# Altium schematic sheet CPLD.SchDoc: =Project
size 420 x 297 mm; Author: G.Kasprowicz; CompanyName: WUT ISE; DrawnBy: G.Kasprowicz; Organization: WUT ISE; Address1: PW ISE; Address2: Nowowiejska 15/19 00-665 Warsaw; Address3: gkasprow@gmail.com; SheetNumber: 2; SheetTotal: 9; ModifiedBy: -; CheckedDate: -; Title2: CPLD; DivGrp: WUT ISE; Designer: G.Kasprowicz; SPICEModelCacheRYPVXPCY: <root> / <DocumentId>RYPVXPCY</DocumentId> / </root>; ModifiedDate: -; ProjectName: Sensor Box
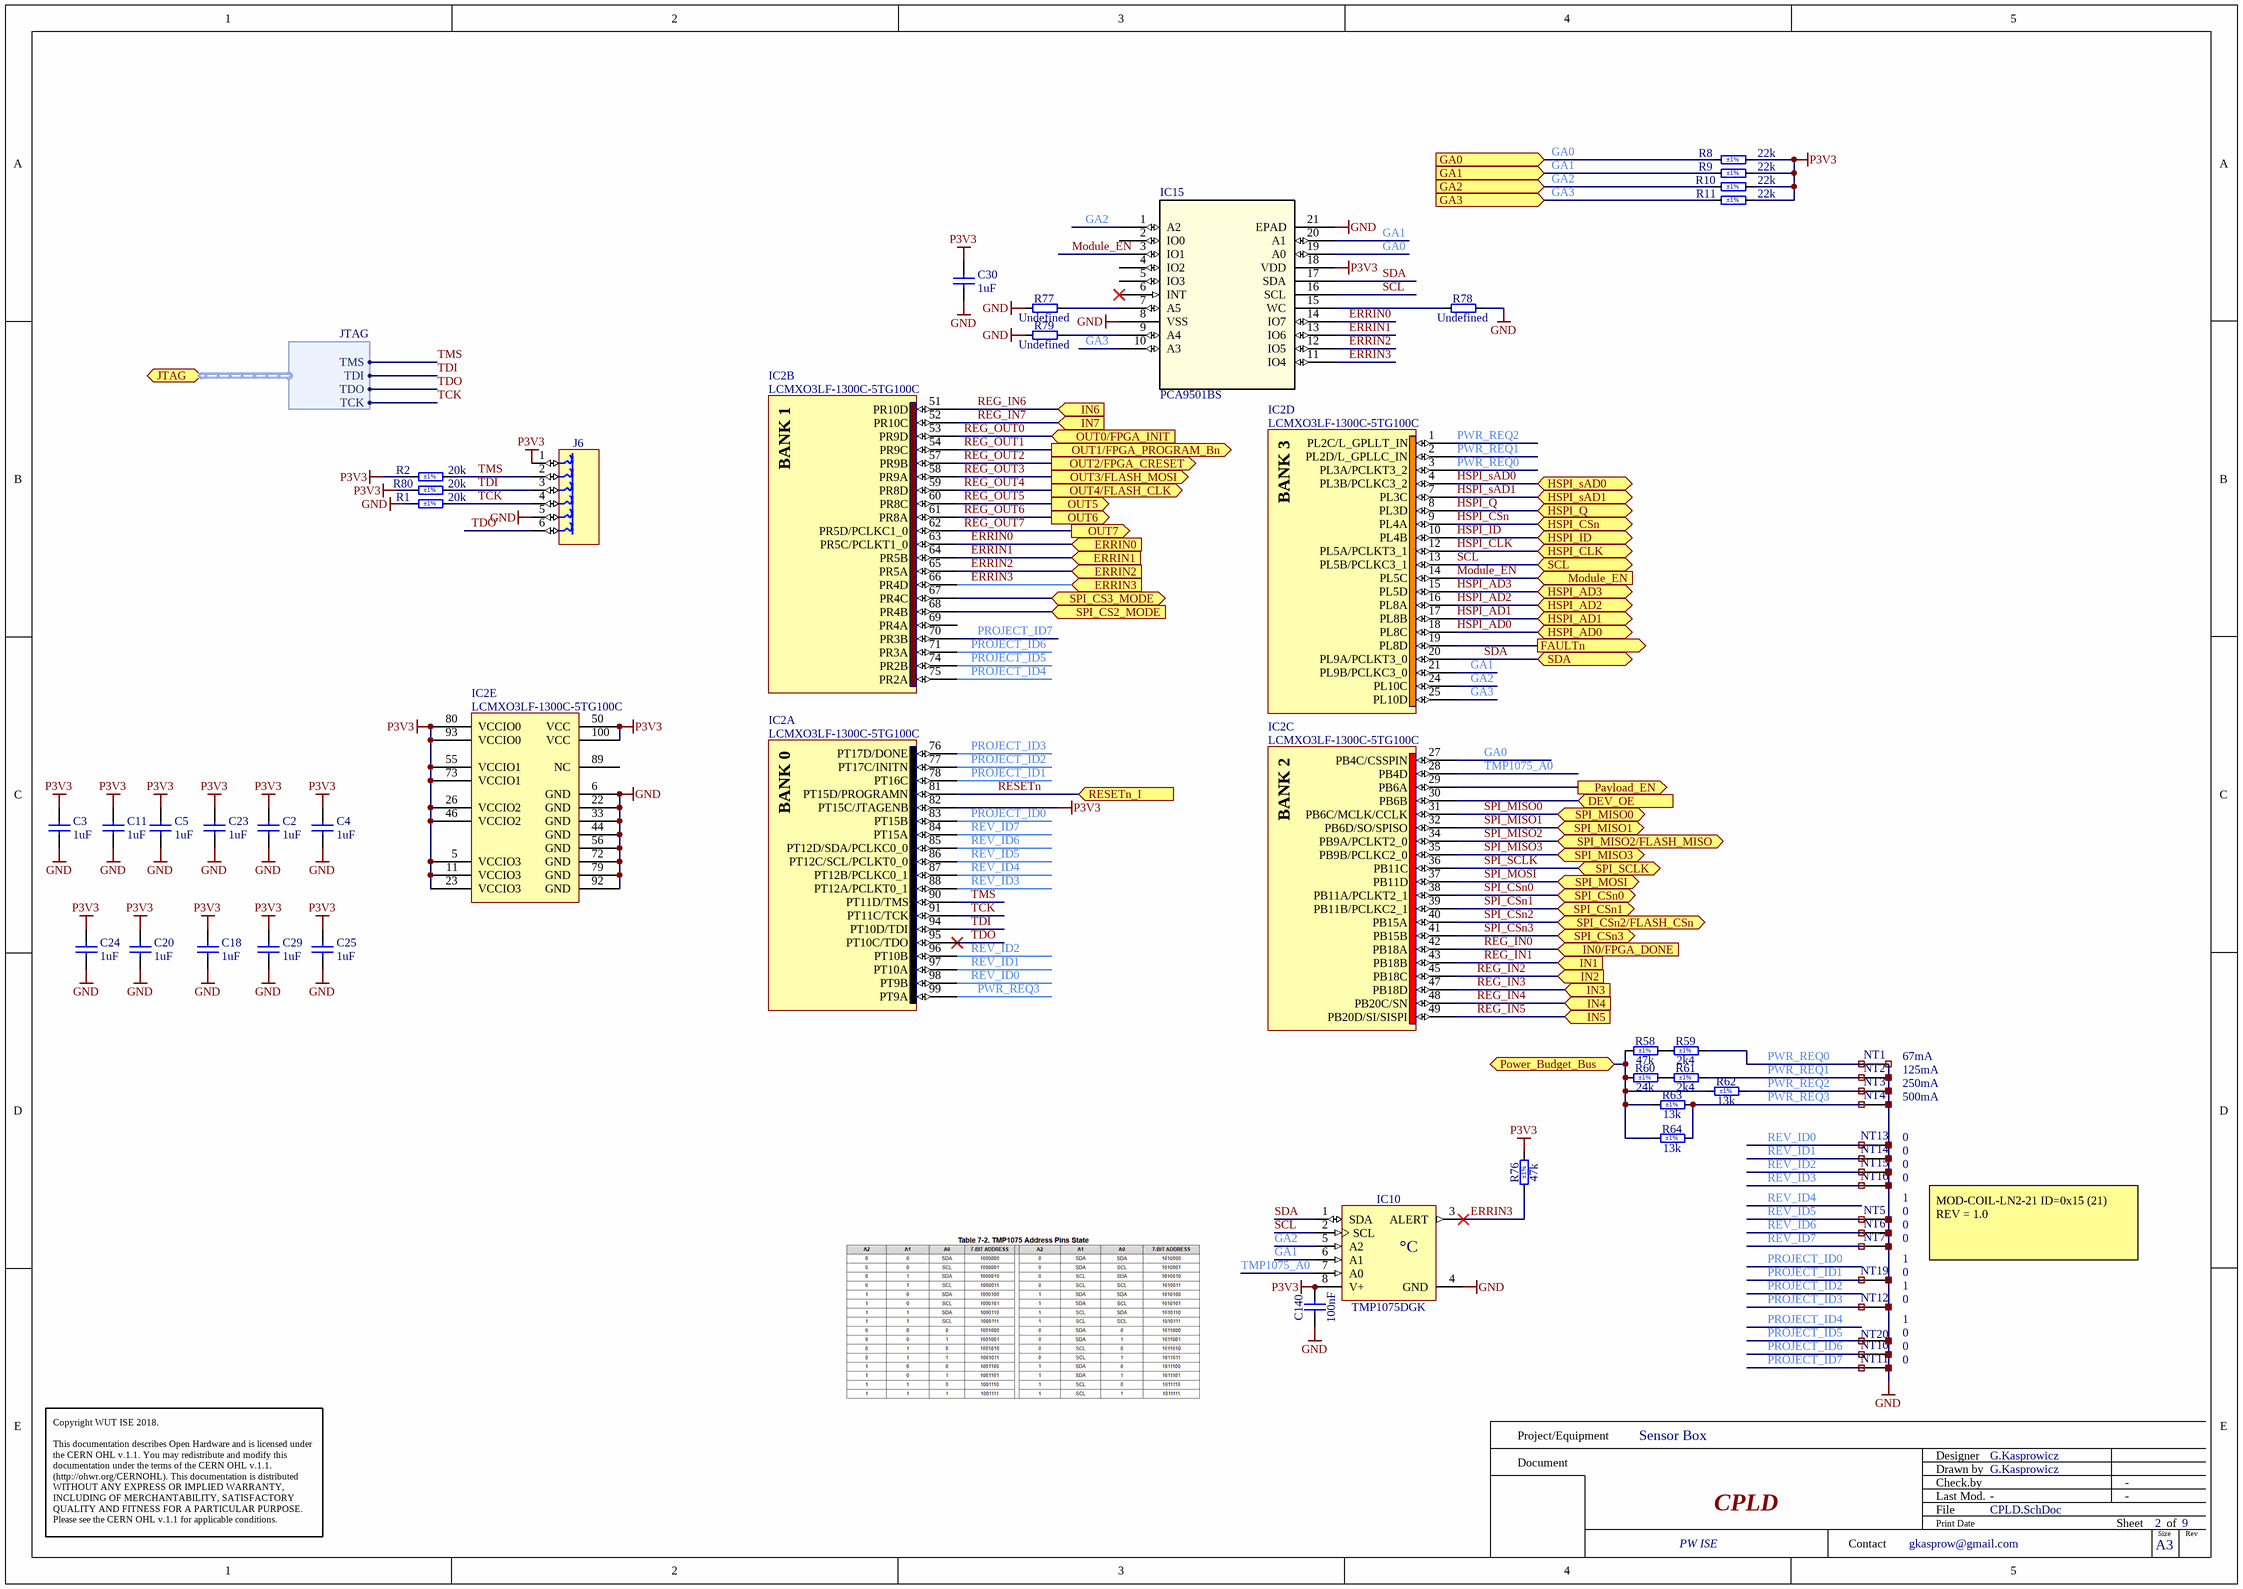
[diagram p0: CPLD.SchDoc]

## Parts
C2  1uF  [CAPC1005X55N]
C3  1uF  [CAPC1005X55N]
C4  1uF  [CAPC1005X55N]
C5  1uF  [CAPC1005X55N]
C11  1uF  [CAPC1005X55N]
C18  1uF  [CAPC1005X55N]
C20  1uF  [CAPC1005X55N]
C23  1uF  [CAPC1005X55N]
C24  1uF  [CAPC1005X55N]
C25  1uF  [CAPC1005X55N]
C29  1uF  [CAPC1005X55N]
C30  1uF  [CAPC1005X55N]
C140  100nF  [CAPC1005X55N]
IC2  LCMXO3LF-1300C-5TG100C  [QFP50P1600X1600X160-100N]  (parts A,B,C,D,E of 5)
IC10  TMP1075DGK  [SOP65P490X110-8N]
IC15  PCA9501BS  [HVQFN20_SOT662-1_5X5_NXP]
J6  TC2030-MCP  [TC2030-MCP]  (value not drawn)  (no BOM)
NT1  Net Tie  [Net Tie 3]  (value not drawn)  (net tie, no BOM)
NT2  Net Tie  [Net Tie 3]  (value not drawn)  (net tie, no BOM)
NT3  Net Tie  [Net Tie 3]  (value not drawn)  (net tie, no BOM)
NT4  Net Tie  [Net Tie 3]  (value not drawn)  (net tie, no BOM)
NT5  Net Tie  [Net Tie 3]  (value not drawn)  (net tie, no BOM)
NT6  Net Tie  [Net Tie 3]  (value not drawn)  (net tie, no BOM)
NT7  Net Tie  [Net Tie 3]  (value not drawn)  (net tie, no BOM)
NT10  Net Tie  [Net Tie 3]  (value not drawn)  (net tie, no BOM)
NT11  Net Tie  [Net Tie 3]  (value not drawn)  (net tie, no BOM)
NT12  Net Tie  [Net Tie 3]  (value not drawn)  (net tie, no BOM)
NT13  Net Tie  [Net Tie 3]  (value not drawn)  (net tie, no BOM)
NT14  Net Tie  [Net Tie 3]  (value not drawn)  (net tie, no BOM)
NT15  Net Tie  [Net Tie 3]  (value not drawn)  (net tie, no BOM)
NT16  Net Tie  [Net Tie 3]  (value not drawn)  (net tie, no BOM)
NT19  Net Tie  [Net Tie 3]  (value not drawn)  (net tie, no BOM)
NT20  Net Tie  [Net Tie 3]  (value not drawn)  (net tie, no BOM)
R1  20k  Tolerance: ±1%  [RESC1005X40N]
R2  20k  Tolerance: ±1%  [RESC1005X40N]
R8  22k  Tolerance: ±1%  [RESC1005X40N]
R9  22k  Tolerance: ±1%  [RESC1005X40N]
R10  22k  Tolerance: ±1%  [RESC1005X40N]
R11  22k  Tolerance: ±1%  [RESC1005X40N]
R58  47k  Tolerance: ±1%  [RESC1005X40N]
R59  2k4  Tolerance: ±1%  [RESC1005X40N]
R60  24k  Tolerance: ±1%  [RESC1005X40N]
R61  2k4  Tolerance: ±1%  [RESC1005X40N]
R62  13k  Tolerance: ±1%  [RESC1005X40N]
R63  13k  Tolerance: ±1%  [RESC1005X40N]
R64  13k  Tolerance: ±1%  [RESC1005X40N]
R76  47k  Tolerance: ±1%  [RESC1005X40N]
R77  Undefined  [RESC1005X40N]
R78  Undefined  [RESC1005X40N]
R79  Undefined  [RESC1005X40N]
R80  20k  Tolerance: ±1%  [RESC1005X40N]

## Ports
DEV_OE (in), ERRIN0 (in), ERRIN1 (in), ERRIN2 (in), ERRIN3 (in), FAULTn (out), GA0 (in), GA1 (in), GA2 (in), GA3 (in), HSPI_AD0 (bidir), HSPI_AD1 (bidir), HSPI_AD2 (bidir), HSPI_AD3 (bidir), HSPI_CLK (bidir), HSPI_CSn (bidir), HSPI_ID (bidir), HSPI_Q (bidir), HSPI_sAD0 (bidir), HSPI_sAD1 (bidir), IN0/FPGA_DONE (in), IN1 (in), IN2 (in), IN3 (in), IN4 (in), IN5 (in), IN6 (in), IN7 (in), JTAG (bidir, harness JTAG), Module_EN (in), OUT0/FPGA_INIT (in), OUT1/FPGA_PROGRAM_Bn (out), OUT2/FPGA_CRESET (out), OUT3/FLASH_MOSI (out), OUT4/FLASH_CLK (out), OUT5 (out), OUT6 (out), OUT7 (out), Payload_EN (out), Power_Budget_Bus (bidir), RESETn_I (in), SCL (bidir), SDA (bidir), SPI_CS2_MODE (in), SPI_CS3_MODE (bidir), SPI_CSn0 (bidir), SPI_CSn1 (bidir), SPI_CSn2/FLASH_CSn (bidir), SPI_CSn3 (bidir), SPI_MISO0 (bidir), SPI_MISO1 (bidir), SPI_MISO2/FLASH_MISO (bidir), SPI_MISO3 (bidir), SPI_MOSI (bidir), SPI_SCLK (bidir)

## Harnesses
JTAG: TMS, TDI, TDO, TCK

## Nets
GND: C2.1 C3.1 C4.1 C5.1 C11.1 C18.1 C20.1 C23.1 C24.1 C25.1 C29.1 C30.1 C140.1 IC2.6(GND) IC2.22(GND) IC2.33(GND) IC2.44(GND) IC2.56(GND) IC2.72(GND) IC2.79(GND) IC2.92(GND) IC10.4(GND) IC15.8(VSS) IC15.21(EPAD) J6.5 NT1.2 NT2.2 NT3.2 NT4.2 NT5.2 NT6.2 NT7.2 NT10.2 NT11.2 NT12.2 NT13.2 NT14.2 NT15.2 NT16.2 NT19.2 NT20.2 R1.2 R77.1 R78.2 R79.1
P3V3: C2.2 C3.2 C4.2 C5.2 C11.2 C18.2 C20.2 C23.2 C24.2 C25.2 C29.2 C30.2 C140.2 IC2.5(VCCIO3) IC2.11(VCCIO3) IC2.23(VCCIO3) IC2.26(VCCIO2) IC2.46(VCCIO2) IC2.50(VCC) IC2.55(VCCIO1) IC2.73(VCCIO1) IC2.80(VCCIO0) IC2.82(PT15C/JTAGENB) IC2.93(VCCIO0) IC2.100(VCC) IC10.8(V+) IC15.18(VDD) J6.1 R2.2 R8.1 R9.1 R10.1 R11.1 R76.2 R80.2
DEV_OE: IC2.30(PB6B) ; port DEV_OE
ERRIN0: IC2.63(PR5C/PCLKT1_0) IC15.14(IO7) ; port ERRIN0
ERRIN1: IC2.64(PR5B) IC15.13(IO6) ; port ERRIN1
ERRIN2: IC2.65(PR5A) IC15.12(IO5) ; port ERRIN2
ERRIN3: IC2.66(PR4D) IC10.3(ALERT) IC15.11(IO4) R76.1 ; port ERRIN3
FAULTn: IC2.19(PL8D) ; port FAULTn
GA0: IC2.27(PB4C/CSSPIN) IC15.19(A0) R8.2 ; port GA0
GA1: IC2.21(PL9B/PCLKC3_0) IC10.6(A1) IC15.20(A1) R9.2 ; port GA1
GA2: IC2.24(PL10C) IC10.5(A2) IC15.1(A2) R10.2 ; port GA2
GA3: IC2.25(PL10D) IC15.10(A3) R11.2 ; port GA3
HSPI_AD0: IC2.18(PL8C) ; port HSPI_AD0
HSPI_AD1: IC2.17(PL8B) ; port HSPI_AD1
HSPI_AD2: IC2.16(PL8A) ; port HSPI_AD2
HSPI_AD3: IC2.15(PL5D) ; port HSPI_AD3
HSPI_CLK: IC2.12(PL5A/PCLKT3_1) ; port HSPI_CLK
HSPI_CSn: IC2.9(PL4A) ; port HSPI_CSn
HSPI_ID: IC2.10(PL4B) ; port HSPI_ID
HSPI_Q: IC2.8(PL3D) ; port HSPI_Q
HSPI_sAD0: IC2.4(PL3B/PCLKC3_2) ; port HSPI_sAD0
HSPI_sAD1: IC2.7(PL3C) ; port HSPI_sAD1
Module_EN: IC2.14(PL5C) IC15.3(IO1) ; port Module_EN
Payload_EN: IC2.29(PB6A) ; port Payload_EN
Power_Budget_Bus: R58.1 R60.1 R62.1 R63.1 R64.1 ; port Power_Budget_Bus
PROJECT_ID0: IC2.83(PT15B)
PROJECT_ID1: IC2.78(PT16C) NT19.1
PROJECT_ID2: IC2.77(PT17C/INITN)
PROJECT_ID3: IC2.76(PT17D/DONE) NT12.1
PROJECT_ID4: IC2.75(PR2A)
PROJECT_ID5: IC2.74(PR2B) NT20.1
PROJECT_ID6: IC2.71(PR3A) NT10.1
PROJECT_ID7: IC2.70(PR3B) NT11.1
PWR_REQ0: IC2.3(PL3A/PCLKT3_2) NT1.1 R59.2
PWR_REQ1: IC2.2(PL2D/L_GPLLC_IN) NT2.1 R61.2
PWR_REQ2: IC2.1(PL2C/L_GPLLT_IN) NT3.1 R62.2
PWR_REQ3: IC2.99(PT9A) NT4.1 R63.2 R64.2
REG_IN0: IC2.42(PB18A) ; port IN0/FPGA_DONE
REG_IN1: IC2.43(PB18B) ; port IN1
REG_IN2: IC2.45(PB18C) ; port IN2
REG_IN3: IC2.47(PB18D) ; port IN3
REG_IN4: IC2.48(PB20C/SN) ; port IN4
REG_IN5: IC2.49(PB20D/SI/SISPI) ; port IN5
REG_IN6: IC2.51(PR10D) ; port IN6
REG_IN7: IC2.52(PR10C) ; port IN7
REG_OUT0: IC2.53(PR9D) ; port OUT0/FPGA_INIT
REG_OUT1: IC2.54(PR9C) ; port OUT1/FPGA_PROGRAM_Bn
REG_OUT2: IC2.57(PR9B) ; port OUT2/FPGA_CRESET
REG_OUT3: IC2.58(PR9A) ; port OUT3/FLASH_MOSI
REG_OUT4: IC2.59(PR8D) ; port OUT4/FLASH_CLK
REG_OUT5: IC2.60(PR8C) ; port OUT5
REG_OUT6: IC2.61(PR8A) ; port OUT6
REG_OUT7: IC2.62(PR5D/PCLKC1_0) ; port OUT7
RESETn: IC2.81(PT15D/PROGRAMN) ; port RESETn_I
REV_ID0: IC2.98(PT9B) NT13.1
REV_ID1: IC2.97(PT10A) NT14.1
REV_ID2: IC2.96(PT10B) NT15.1
REV_ID3: IC2.88(PT12A/PCLKT0_1) NT16.1
REV_ID4: IC2.87(PT12B/PCLKC0_1)
REV_ID5: IC2.86(PT12C/SCL/PCLKT0_0) NT5.1
REV_ID6: IC2.85(PT12D/SDA/PCLKC0_0) NT6.1
REV_ID7: IC2.84(PT15A) NT7.1
SCL: IC2.13(PL5B/PCLKC3_1) IC10.2(SCL) IC15.16(SCL) ; port SCL
SDA: IC2.20(PL9A/PCLKT3_0) IC10.1(SDA) IC15.17(SDA) ; port SDA
SPI_CS2_MODE: IC2.68(PR4B) ; port SPI_CS2_MODE
SPI_CS3_MODE: IC2.67(PR4C) ; port SPI_CS3_MODE
SPI_CSn0: IC2.38(PB11A/PCLKT2_1) ; port SPI_CSn0
SPI_CSn1: IC2.39(PB11B/PCLKC2_1) ; port SPI_CSn1
SPI_CSn2: IC2.40(PB15A) ; port SPI_CSn2/FLASH_CSn
SPI_CSn3: IC2.41(PB15B) ; port SPI_CSn3
SPI_MISO0: IC2.31(PB6C/MCLK/CCLK) ; port SPI_MISO0
SPI_MISO1: IC2.32(PB6D/SO/SPISO) ; port SPI_MISO1
SPI_MISO2: IC2.34(PB9A/PCLKT2_0) ; port SPI_MISO2/FLASH_MISO
SPI_MISO3: IC2.35(PB9B/PCLKC2_0) ; port SPI_MISO3
SPI_MOSI: IC2.37(PB11D) ; port SPI_MOSI
SPI_SCLK: IC2.36(PB11C) ; port SPI_SCLK
TCK: IC2.91(PT11C/TCK) J6.4 R1.1 ; port JTAG.TCK
TDI: IC2.94(PT10D/TDI) J6.3 R80.1 ; port JTAG.TDI
TDO: IC2.95(PT10C/TDO) J6.6 ; port JTAG.TDO
TMP1075_A0: IC2.28(PB4D) IC10.7(A0)
TMS: IC2.90(PT11D/TMS) J6.2 R2.1 ; port JTAG.TMS
NetIC15_7: IC15.7(A5) R77.2
NetIC15_9: IC15.9(A4) R79.2
NetIC15_15: IC15.15(WC) R78.1
NetR58_2: R58.2 R59.1
NetR60_2: R60.2 R61.1

Not connected (* = marked no-connect by the designer): IC2 69(PR4A) 89(NC); IC15 2(IO0) 4(IO2) 5(IO3) 6(INT)*

## Notes on the sheet
- 125mA
- 67mA
- 500mA
- 250mA
- 0
- 1
- MOD-COIL-LN2-21 ID=0x15 (21)
  REV = 1.0
- Project/Equipment
- Document
- Designer
- Drawn by
- Check.by
- Copyright WUT ISE 2018.
  This documentation describes Open Hardware and is licensed under the CERN OHL v.1.1. You may redistribute and modify this documentation under the terms of the CERN OHL v.1.1. (http://ohwr.org/CERNOHL). This documentation is distributed WITHOUT ANY EXPRESS OR IMPLIED WARRANTY, INCLUDING OF MERCHANTABILITY, SATISFACTORY QUALITY AND FITNESS FOR A PARTICULAR PURPOSE. Please see the CERN OHL v.1.1 for applicable conditions.
- Contact
- File
- Last Mod.
- Print Date
- Sheet
- Size
- A3
- of
- Rev
- (in symbol LCMXO3LF-1300C-5TG100C, part A) BANK 0
- (in symbol LCMXO3LF-1300C-5TG100C, part B) BANK 1
- (in symbol LCMXO3LF-1300C-5TG100C, part C) BANK 2
- (in symbol LCMXO3LF-1300C-5TG100C, part D) BANK 3
- (in symbol TMP1075DGK) °C

## Library data of the parts
C2-C5 C11 C18 C20 C23-C25 C29 C30 = CC0402_1UF_16V_10%_X5R: Non-polarised capacitor; Part Description: SMD Multilayer Chip Ceramic Capacitor; Manufacturer: GENERIC; Manufacturer1 Part Number: C1005X5R1C105KT; Voltage: 16V; TC: X5R; Tolerance: ±10%; Part Number: CC0402_1UF_16V_10%_X5R; Component Kind: Standard; Component Type: Standard; Pin Count: 2; Value: 1uF; Status: Preferred; Manufacturer Part Number: CC0402_1UF_16V_10%_X5R; Case: 0402; Mounted: Yes; Socket: No; SMD: Yes; Sense: No; Manufacturer1 Example: TDK; Manufacturer1 ComponentHeight: 0.55mm; HelpURL: \\cern.ch\dfs\Applications\Altium\Datasheets\CC0402_X5R_TDK_C.pdf; Author: CERN DEM JLC; CreateDate: 25.10.2012; LatestRevisionDate: 25.10.2012
C140 = CC0402_100NF_16V_10%_X7R: Non-polarised capacitor; Part Description: SMD Multilayer Chip Ceramic Capacitor; Manufacturer: GENERIC; Manufacturer1 Part Number: GRM155R71C104KA88D; Voltage: 16V; TC: X7R; Tolerance: ±10%; Part Number: CC0402_100NF_16V_10%_X7R; Component Kind: Standard; Component Type: Standard; Pin Count: 2; Value: 100nF; Status: Not Recommended; Manufacturer Part Number: CC0402_100NF_16V_10%_X7R; Case: 0402; Mounted: Yes; Socket: No; SMD: Yes; Sense: No; Manufacturer1 Example: MURATA; Manufacturer1 ComponentHeight: 0.55mm; HelpURL: \\cern.ch\dfs\Applications\Altium\Datasheets\CC0402_X7R_MURATA_GRM.pdf; Author: CERN DEM JLC; CreateDate: 05.12.2013; LatestRevisionDate: 03.12.2007
IC2 = LCMXO3LF-1300C-5TG100C: MachXO2, 2.5V/3.3V High-Performance 2000 Macrocell CPLD, 80 I/Os, 100-Pin TQFP, Speed Grade 4, Industrial Grade; Part Description: MachXO3LF, 2.5V/3.3V Low-Density Ultra-Low Power FPGA, 1300 LUTs, 80 I/Os, 100-Pin TQFP, Speed Grade 5, Commercial Grade; Manufacturer: LATTICE SEMICONDUCTOR; PressFit: No; Bonding: No; Part Number: LCMXO3LF-1300C-5TG100C; Component Kind: Standard; Component Type: Standard; Device: LCMXO3LF-1300C-5TG100C; PackageDescription: QFP, 0.50mm Pitch, Square; 100 Pin, 14.0mm L X 14.0mm W X 1.60mm H body, IPC Medium Density; Manufacturer Part Number: LCMXO3LF-1300C-5TG100C; Pin Count: 100; Case: QFP100; Mounted: Yes; Socket: No; SMD: Yes; Sense: No; ComponentHeight: 1.6mm; HelpURL: \\cern.ch\dfs\Applications\Altium\Datasheets\LCMXO3LF_Serie.pdf; ComponentLink1URL: \\cern.ch\dfs\Applications\Altium\Datasheets\LATTICE_Package.pdf; ComponentLink1Description: Package Drawing; ComponentLink2URL: \\cern.ch\dfs\Applications\Altium\Datasheets\LCMXO3LF-1300C-5TG100_Pinout.pdf; ComponentLink2Description: Pinout; Author: CERN DEM MR; CreateDate: 18.06.2019; LatestRevisionDate: 18.06.2019
IC10 = TMP1075DGK: High Accuracy Temperature Sensor With I2C and SMBus Interface in Industry Standard LM75; Manufacturer: TEXAS INSTRUMENTS; PressFit: No; Bonding: No; Part Number: TMP1075DGK; Component Kind: Standard; Component Type: Standard; Device: TMP1075DGK; PackageDescription: SOP, 0.65mm Pitch; 8 Pin, 3.00mm W X 3.00mm L X 1.10mm H body, IPC Medium Density; Part Description: High Accuracy Temperature Sensor with I2C and SMBus Interface in Industry Standard LM75; Manufacturer Part Number: TMP1075DGK; Pin Count: 8; Case: uSOP8; Mounted: Yes; Socket: No; SMD: Yes; Sense: No; ComponentHeight: 1.1mm; HelpURL: \\cern.ch\dfs\Applications\Altium\Datasheets\TMP1075DGK.pdf; Author: CERN DEM MR; CreateDate: 04.10.2019; LatestRevisionDate: 04.10.2019
IC15 = IFC_PCA9501BS: 8-bit I2C-bus and SMBus I/O port with interrupt, 2-kbit / EEPROM and 6 address pins; Manufacturer: NXP; Manufacturer Part Number: PCA9501BS,118; Part Number: PCA9501BS
J6 = TC2030-MCP: TC2030-MCP and TC2030-MCP-NL Pad Contact; Part Description: 6 X 31mil Diameter SMD Pad For TC2030-MCP Legged Connector; Mounted: No; Part Number: TC2030-MCP; Component Type: Standard (No BOM); Pin Count: 6; Family: TC2030-MCP; Socket: No; SMD: Yes; Sense: No; Status: None; ComponentHeight: 0mm; HelpURL: \\cern.ch\dfs\Applications\Altium\Datasheets\TC2030-MCP.pdf; Author: CERN DEM HF; CreateDate: 27.03.2023; LatestRevisionDate: 27.03.2023; PackageDescription: 6 X 31mil Diameter SMD Pad For TC2030-MCP Legged Connector
NT1-NT7 NT10-NT16 NT19 NT20 = Net Tie 3: Part Description: Net Tie (2 Nets); Mounted: No; Part Number: Net Tie 3; Component Type: Net Tie; Pin Count: 2; Family: Net Tie; Socket: No; SMD: No; Sense: No; Status: None; ComponentHeight: 0mm; HelpURL: Undefined; Author: CERN DEM HF; CreateDate: 23.09.2024; LatestRevisionDate: 23.09.2024; PackageDescription: SMD Net Tie
R1 R2 R80 = R0402_20K_1%_0.0625W_100PPM: Resistor - 1%; Part Description: General Purpose Thick Film Chip Resistor; Manufacturer: GENERIC; Manufacturer1 Part Number: 232270672003L; TC: ±100ppm/°C; PressFit: No; Part Number: R0402_20K_1%_0.0625W_100PPM; Component Kind: Standard; Component Type: Standard; Pin Count: 2; Value: 20k; Status: Not Recommended; Power: 0.0625W; Manufacturer Part Number: R0402_20K_1%_0.0625W_100PPM; Case: 0402; Mounted: Yes; Sense: No; Socket: No; SMD: Yes; Manufacturer1 Example: YAGEO PHYCOMP; Manufacturer1 ComponentHeight: 0.4mm; HelpURL: \\cern.ch\dfs\Applications\Altium\Datasheets\R0402_Phycomp_RC0402.pdf; Author: CERN DEM JLC; CreateDate: 03.12.2007; LatestRevisionDate: 17.10.2012
R8-R11 = R0402_22K_1%_0.0625W_100PPM: Resistor - 1%; Part Description: General Purpose Thick Film Chip Resistor; Manufacturer: GENERIC; Manufacturer1 Part Number: 232270672203L; TC: ±100ppm/°C; PressFit: No; Part Number: R0402_22K_1%_0.0625W_100PPM; Component Kind: Standard; Component Type: Standard; Pin Count: 2; Value: 22k; Status: Not Recommended; Power: 0.0625W; Manufacturer Part Number: R0402_22K_1%_0.0625W_100PPM; Case: 0402; Mounted: Yes; Sense: No; Socket: No; SMD: Yes; Manufacturer1 Example: YAGEO PHYCOMP; Manufacturer1 ComponentHeight: 0.4mm; HelpURL: \\cern.ch\dfs\Applications\Altium\Datasheets\R0402_Phycomp_RC0402.pdf; Author: CERN DEM JLC; CreateDate: 03.12.2007; LatestRevisionDate: 17.10.2012
R58 R76 = R0402_47K_1%_0.0625W_100PPM: Resistor - 1%; Part Description: General Purpose Thick Film Chip Resistor; Manufacturer: GENERIC; Manufacturer1 Part Number: 232270674703L; TC: ±100ppm/°C; PressFit: No; Part Number: R0402_47K_1%_0.0625W_100PPM; Component Kind: Standard; Component Type: Standard; Pin Count: 2; Value: 47k; Status: Not Recommended; Power: 0.0625W; Manufacturer Part Number: R0402_47K_1%_0.0625W_100PPM; Case: 0402; Mounted: Yes; Sense: No; Socket: No; SMD: Yes; Manufacturer1 Example: YAGEO PHYCOMP; Manufacturer1 ComponentHeight: 0.4mm; HelpURL: \\cern.ch\dfs\Applications\Altium\Datasheets\R0402_Phycomp_RC0402.pdf; Author: CERN DEM JLC; CreateDate: 03.12.2007; LatestRevisionDate: 17.10.2012
R59 R61 = R0402_2K4_1%_0.0625W_100PPM: Resistor - 1%; Part Description: General Purpose Thick Film Chip Resistor; Manufacturer: GENERIC; Manufacturer1 Part Number: 232270672402L; TC: ±100ppm/°C; PressFit: No; Part Number: R0402_2K4_1%_0.0625W_100PPM; Component Kind: Standard; Component Type: Standard; Pin Count: 2; Value: 2k4; Status: Not Recommended; Power: 0.0625W; Manufacturer Part Number: R0402_2K4_1%_0.0625W_100PPM; Case: 0402; Mounted: Yes; Sense: No; Socket: No; SMD: Yes; Manufacturer1 Example: YAGEO PHYCOMP; Manufacturer1 ComponentHeight: 0.4mm; HelpURL: \\cern.ch\dfs\Applications\Altium\Datasheets\R0402_Phycomp_RC0402.pdf; Author: CERN DEM JLC; CreateDate: 03.12.2007; LatestRevisionDate: 17.10.2012
R60 = R0402_24K_1%_0.0625W_100PPM: Resistor - 1%; Part Description: General Purpose Thick Film Chip Resistor; Manufacturer: GENERIC; Manufacturer1 Part Number: 232270672403L; TC: ±100ppm/°C; PressFit: No; Part Number: R0402_24K_1%_0.0625W_100PPM; Component Kind: Standard; Component Type: Standard; Pin Count: 2; Value: 24k; Status: Not Recommended; Power: 0.0625W; Manufacturer Part Number: R0402_24K_1%_0.0625W_100PPM; Case: 0402; Mounted: Yes; Sense: No; Socket: No; SMD: Yes; Manufacturer1 Example: YAGEO PHYCOMP; Manufacturer1 ComponentHeight: 0.4mm; HelpURL: \\cern.ch\dfs\Applications\Altium\Datasheets\R0402_Phycomp_RC0402.pdf; Author: CERN DEM JLC; CreateDate: 03.12.2007; LatestRevisionDate: 17.10.2012
R62-R64 = R0402_13K_1%_0.0625W_100PPM: Resistor - 1%; Part Description: General Purpose Thick Film Chip Resistor; Manufacturer: GENERIC; Manufacturer1 Part Number: 232270671303L; TC: ±100ppm/°C; PressFit: No; Part Number: R0402_13K_1%_0.0625W_100PPM; Component Kind: Standard; Component Type: Standard; Pin Count: 2; Value: 13k; Status: Not Recommended; Power: 0.0625W; Manufacturer Part Number: R0402_13K_1%_0.0625W_100PPM; Case: 0402; Mounted: Yes; Sense: No; Socket: No; SMD: Yes; Manufacturer1 Example: YAGEO PHYCOMP; Manufacturer1 ComponentHeight: 0.4mm; HelpURL: \\cern.ch\dfs\Applications\Altium\Datasheets\R0402_Phycomp_RC0402.pdf; Author: CERN DEM JLC; CreateDate: 03.12.2007; LatestRevisionDate: 17.10.2012
R77-R79 = R0402_NO-VALUE: Resistor; Part Description: Reserved Footprint For a 0402 (1005) Chip Resistor; PressFit: No; Mounted: No; Part Number: R0402_NO-VALUE; Component Kind: Standard; Component Type: Standard; Pin Count: 2; Value: Undefined; Status: None; Manufacturer: Undefined; Manufacturer Part Number: R0402_NO-VALUE; Case: 0402; Sense: No; Socket: No; SMD: Yes; Manufacturer1 Example: Undefined; Manufacturer1 Part Number: Undefined; Manufacturer1 ComponentHeight: Undefined; HelpURL: Undefined; Author: CERN DEM JLC; CreateDate: 03.12.2007; LatestRevisionDate: 13.03.2008